# Altium schematic sheet Analog_Multiplier.SchDoc
size A4
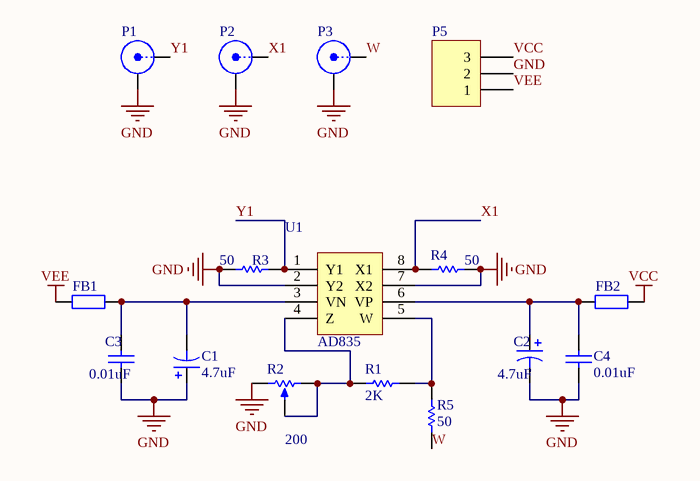
[diagram p0: Analog_Multiplier.SchDoc]

## Parts
C1  value 4.7uF  [0805]  (hidden comment: Cap Pol3)
C2  value 4.7uF  [0805]  (hidden comment: Cap Pol3)
C3  value 0.01uF  [0805]  (hidden comment: Cap Semi)
C4  value 0.01uF  [0805]  (hidden comment: Cap Semi)
FB1  Res2  [1206]  (value not drawn)
FB2  Res2  [1206]  (value not drawn)
P1  SMB  [SMB_V-RJ45]  (value not drawn)
P2  SMB  [SMB_V-RJ45]  (value not drawn)
P3  SMB  [SMB_V-RJ45]  (value not drawn)
P5  Header 3  [HDR1X3]  (value not drawn)
R1  value 2K  [AXIAL-0.3]  (hidden comment: Res1)
R2  value 200  [VR5]  (hidden comment: RPot)
R3  value 50  [0805]  (hidden comment: Res1)
R4  value 50  [0805]  (hidden comment: Res1)
R5  value 50  [0805]  (hidden comment: Res1)
U1  AD835  [AD835_SOP8 - duplicate1]

## Nets
GND: C1.1 C2.2 C3.2 C4.2 P1.2(Y) P2.2(Y) P3.2(Y) P5.2 R2.1(TOP) R3.2 R4.1 U1.2(Y2) U1.7(X2)
VCC: FB2.1 P5.3
VEE: FB1.2 P5.1
W: P3.1(X) R5.1
X1: P2.1(X) R4.2 U1.8(X1)
Y1: P1.1(X) R3.1 U1.1(Y1)
NetC1_2: C1.2 C3.1 FB1.1 U1.3(VN)
NetC2_1: C2.1 C4.1 FB2.2 U1.6(VP)
NetR1_1: R1.1 R2.2(TAP) R2.3(BOT) U1.4(Z)
NetR1_2: R1.2 R5.2 U1.5(W)

## Library data of the parts
C1 C2 = Cap Pol3: Polarized Capacitor (Surface Mount); Published: 8-Jun-2000; LatestRevisionDate: 29-May-2009; LatestRevisionNote: IPC-7351 Footprint Added.; PackageReference: C0805; Publisher: Altium Limited; PackageDescription: Chip Capacitor
C3 C4 = Cap Semi: Capacitor (Semiconductor SIM Model); Published: 8-Jun-2000; LatestRevisionDate: 29-May-2009; LatestRevisionNote: IPC-7351 Footprint Added.; PackageReference: C1206; Publisher: Altium Limited; PackageDescription: Chip Capacitor
FB1 FB2 = Res2: Resistor; Value: 1K; Published: 8-Jun-2000; LatestRevisionDate: 17-Jul-2002; LatestRevisionNote: Re-released for DXP Platform.; PackageReference: AXIAL-0.4; Publisher: Altium Limited; PackageDescription: Axial Device, Thru-Hole; 2 Leads; 0.4 in Pin Spacing
P1-P3 = SMB: SMB Straight Connector; LatestRevisionDate: 17-Jul-2002; LatestRevisionNote: Re-released for DXP Platform.; Publisher: Altium Limited
P5 = Header 3: Header, 3-Pin; LatestRevisionDate: 17-Jul-2002; LatestRevisionNote: Re-released for DXP Platform.; Publisher: Altium Limited
R1 R3-R5 = Res1: Resistor; Published: 8-Jun-2000; LatestRevisionDate: 17-Jul-2002; LatestRevisionNote: Re-released for DXP Platform.; PackageReference: AXIAL-0.3; Publisher: Altium Limited; PackageDescription: Axial Device, Thru-Hole; 2 Leads; 0.3 in Pin Spacing
R2 = RPot: Potentiometer; Sim Note: Enter the Resistance value and the set point into parameter fields.; Set Position: 0.5; Published: 8-Jun-2000; LatestRevisionDate: 17-Jul-2002; LatestRevisionNote: Re-released for DXP Platform.; PackageReference: VR5; Publisher: Altium Limited; PackageDescription: Variable Resistor, Thru-Hole; 3 Leads
U1 = Component_1